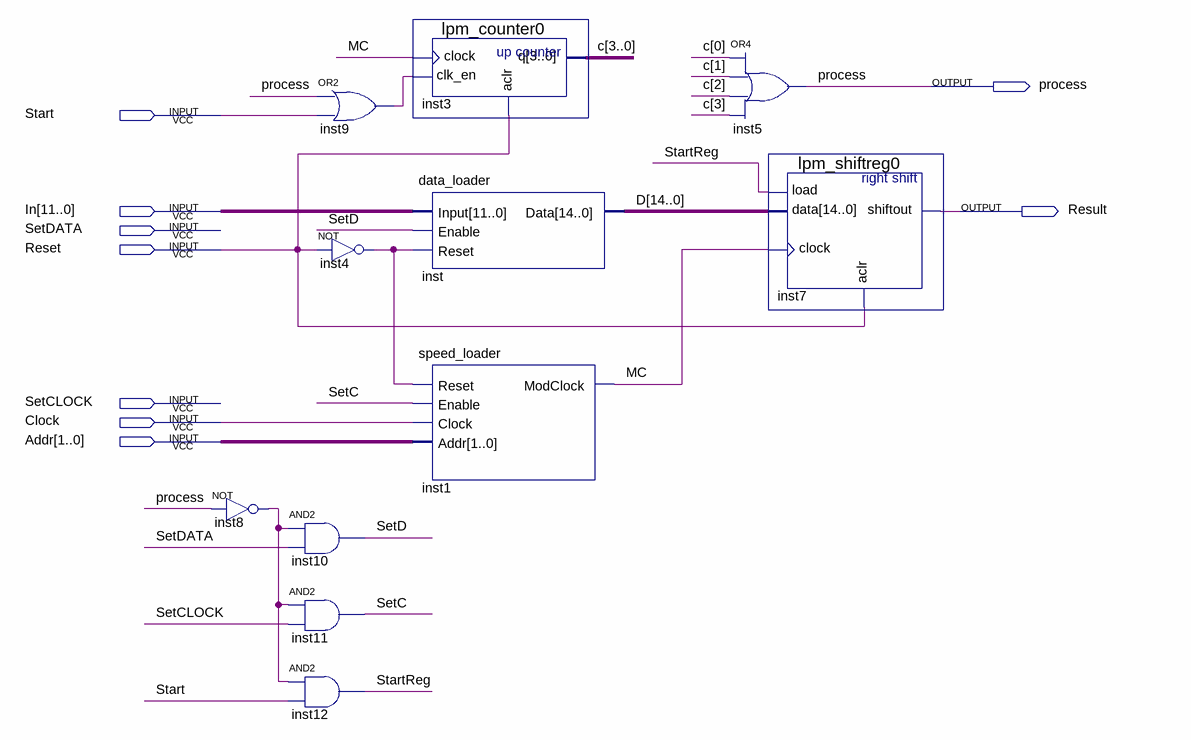
[diagram p0: schematic sheet]
// Quartus schematic shift_reg.bdf as structural Verilog: 11 symbols, 9 pins
module shift_reg (
  input  Start,
  input  [11:0] In,
  input  SetDATA,
  input  Reset,
  input  SetCLOCK,
  input  Clock,
  input  [1:0] Addr,
  output process,
  output Result
);

  wire inst4_out, inst8_out, inst9_out, MC, SetC, SetD, StartReg;
  wire [3:0] c;
  wire [14:0] D;

  not inst8 (inst8_out, process);
  or inst9 (inst9_out, process, Start);
  not inst4 (inst4_out, Reset);
  and inst10 (SetD, inst8_out, SetDATA);
  and inst11 (SetC, inst8_out, SetCLOCK);
  and inst12 (StartReg, inst8_out, Start);
  lpm_counter0 inst3 (.clock(MC), .clk_en(inst9_out), .aclr(Reset), .q(c));
  data_loader inst (.Input(In), .Enable(SetD), .Reset(inst4_out), .Data(D));
  speed_loader inst1 (.Reset(inst4_out), .Enable(SetC), .Clock(Clock), .Addr(Addr), .ModClock(MC));
  or inst5 (process, c[0], c[1], c[2], c[3]);
  lpm_shiftreg0 inst7 (.load(StartReg), .data(D), .clock(MC), .aclr(Reset), .shiftout(Result));
endmodule
